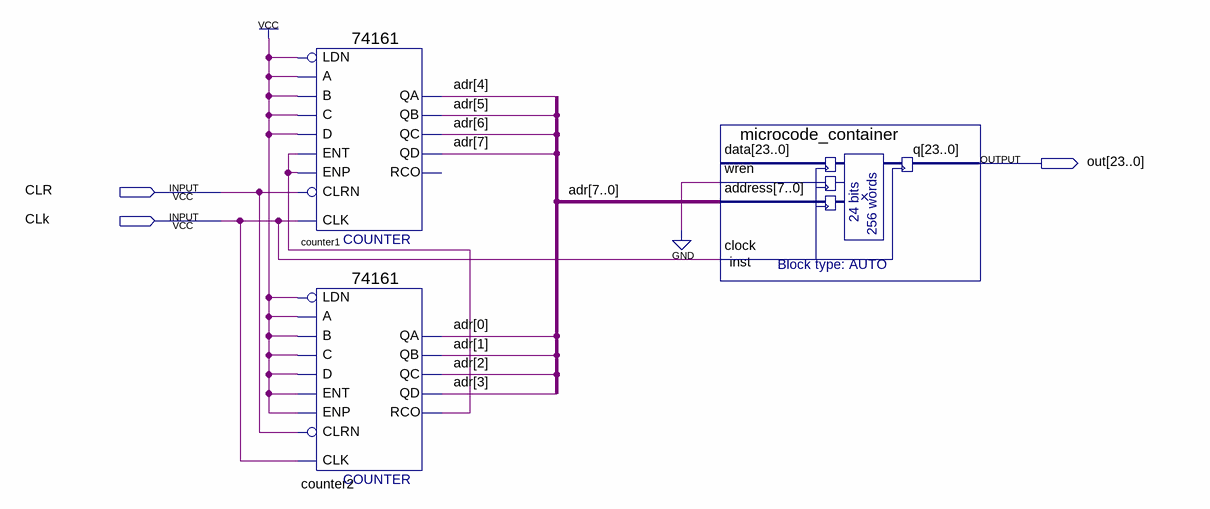
[diagram p0: schematic sheet]
// Quartus schematic experiment13.bdf as structural Verilog: 3 symbols, 3 pins
module experiment13 (
  input  CLR,
  input  CLk,
  output [23:0] out
);

  wire counter2_rco;
  wire [7:0] adr;

  \74161  counter1 (
    .CLRN(CLR), .CLK(CLk), .ENP(counter2_rco), .LDN(1'b1), .A(1'b1), .D(1'b1), .ENT(counter2_rco), .B(1'b1),
    .C(1'b1), .QD(adr[7]), .QC(adr[6]), .QB(adr[5]), .QA(adr[4]));  // open: RCO
  \74161  counter2 (
    .CLRN(CLR), .CLK(CLk), .ENP(1'b1), .LDN(1'b1), .A(1'b1), .D(1'b1), .ENT(1'b1), .B(1'b1), .C(1'b1),
    .QD(adr[3]), .QC(adr[2]), .QB(adr[1]), .QA(adr[0]), .RCO(counter2_rco));
  microcode_container inst (.wren(1'b0), .address(adr), .clock(CLk), .q(out));  // open: data
endmodule
